# Altium schematic sheet 02_Connectors.SchDoc: Off Board Connectors
size A; Revision: A; SheetNumber: 2; SheetTotal: 4; ECE315_Project_Name: ECE453 F23 Base Project
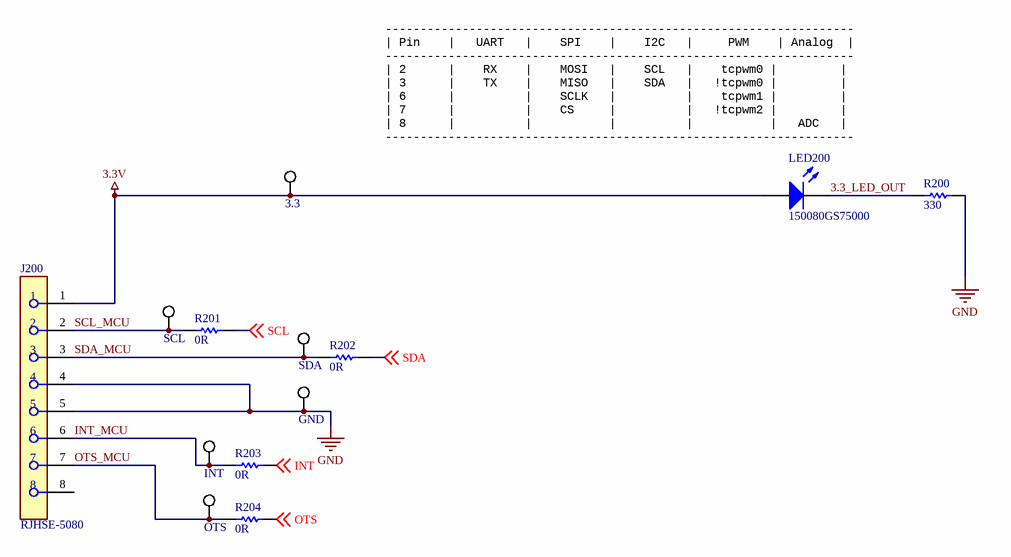
[diagram p0: 02_Connectors.SchDoc]

## Parts
3.3  5019  [KSTN-5019_V]  (value not drawn)
GND  5019  [KSTN-5019_V]  (value not drawn)
INT  5019  [KSTN-5019_V]  (value not drawn)
J200  RJHSE-5080  [FP-RJHSE-5080-MFG]
LED200  150080GS75000  [0805_A]
OTS  5019  [KSTN-5019_V]  (value not drawn)
R200  Resistance: 330  [RESC2013X60X35LL10T20]  (hidden comment: RC0805FR-07330RL)
R201  value 0R  [RES_0805]  (hidden comment: ERJ-6GEY0R00V)
R202  value 0R  [RESC2013X70X40NL20T20]  (hidden comment: ERJ-6GEY0R00V)
R203  value 0R  [RESC2013X70X40NL20T20]  (hidden comment: ERJ-6GEY0R00V)
R204  value 0R  [RESC2013X70X40NL20T20]  (hidden comment: ERJ-6GEY0R00V)
SCL  5019  [KSTN-5019_V]  (value not drawn)
SDA  5019  [KSTN-5019_V]  (value not drawn)

## Nets
3.3V: 3.3.1 J200.1 LED200.2(A)
GND: GND.1 J200.4 J200.5 R200.2
3.3_LED_OUT: LED200.1(K) R200.1
INT: R203.2 ; off-sheet INT
INT_MCU: INT.1 J200.6 R203.1
OTS: R204.2 ; off-sheet OTS
OTS_MCU: J200.7 OTS.1 R204.1
SCL: R201.2 ; off-sheet SCL
SCL_MCU: J200.2 R201.1 SCL.1
SDA: R202.2 ; off-sheet SDA
SDA_MCU: J200.3 R202.1 SDA.1

Not connected (* = marked no-connect by the designer): J200 8

## Notes on the sheet
- -------------------------------------------------------------------
  | Pin    |   UART   |    SPI    |    I2C   |     PWM    | Analog  |
  -------------------------------------------------------------------
  | 2      |    RX    |    MOSI   |    SCL   |    tcpwm0 |         |
  | 3      |    TX    |    MISO   |    SDA   |   !tcpwm0 |         |
  | 6      |          |    SCLK   |          |    tcpwm1 |         |
  | 7      |          |    CS     |          |   !tcpwm2 |         |
  | 8      |          |           |          |           |   ADC   |
  -------------------------------------------------------------------
- Title:
- Size:
- A
- Project
- Rev:
- Sheet:
- of
- College of Engineering
- 1415 Engineering Drive
- Madison, WI 53706

## Library data of the parts
3.3 GND INT OTS SCL SDA = CMP-1672-00008-1: Test Point, 1 Position SMD, RoHS, Tape and Reel; Manufacturer: Keystone Electronics; Plating: Silver; Body Material: Bronze; Supplier: Newark; Supplier Part Number: 59Y8500; Manufacturer Part Number: 5019; RoHS: Yes; Category: Connectors; Stock: 11269; Pricing: 1=0.411, 10=0.389, 25=0.285, 50=0.279, 100=0.273, 250=0.246 (USD); Mounting Technology: Surface Mount,PCB; Pins: 1; Contact Plating: Silver; Contact Material: Bronze; Material: Bronze; Packaging: Tape and Reel; Package Quantity: 1; Termination: SMD/SMT; Series: 5019; Height: 0.09inch; Reach SVHC Compliant: No; RoHS Compliant: Yes; Lead Free: Lead Free; ComponentLink1URL: https://datasheet.ciiva.com/14848/m60-2p61-14848437.pdf?src-supplier=Digi-Key; ComponentLink1Description: https://datasheet.ciiva.com/14848/m60-2p61-14848437.pdf?src-supplier=Digi-Key; ComponentLink2URL: https://datasheet.ciiva.com/14848/m60-2p61-14848438.pdf?src-supplier=Digi-Key; ComponentLink2Description: https://datasheet.ciiva.com/14848/m60-2p61-14848438.pdf?src-supplier=Digi-Key; ComponentLink3URL: https://datasheet.ciiva.com/14848/m60-2p61-14848439.pdf?src-supplier=Digi-Key; ComponentLink3Description: https://datasheet.ciiva.com/14848/m60-2p61-14848439.pdf?src-supplier=Digi-Key; ComponentLink4URL: https://datasheet.ciiva.com/16318/m60-2p61-16318395.pdf?src-supplier=Future+Electronics; ComponentLink4Description: https://datasheet.ciiva.com/16318/m60-2p61-16318395.pdf?src-supplier=Future+Electronics; ComponentLink5URL: https://datasheet.ciiva.com/16885/70182998-16885945.pdf?src-supplier=Allied+Electronics; ComponentLink5Description: https://datasheet.ciiva.com/16885/70182998-16885945.pdf?src-supplier=Allied+Electronics
J200 = CMP-02366-000003-1: CONN MOD JACK 8P8C R/A UNSHLD; Manufacturer: Amphenol; Current Rating: 1.5A; Voltage Rating: 125V; Pitch: 1.02mm; Conn Orientation: Right Angle; Number Of Contacts: 8; Is Female: yes; Conn Gender: Female; Contact Resistance: 20mR; Number of Ports: 1; Connector Type: RJ45; Lead Free: Yes; Device Class L3: unset; Footprint Url: https://cdn.amphenol-icc.com/media/wysiwyg/files/drawing/rjhse5080.pdf?__cf_chl_jschl_tk__=e349db0bbbb6188a39347cd5e541b92fa02c9719-1587748343-0-AW7tChdeHzRPLX9gSWj7WrKaXQoY9BsmT9Ek0h-T62M9y3Rs9iypFcOtkzb-6sGYQEjFE-jcoNciDETCOZrh1rYyOesac5SvYLoLwHIsHvF4AKBlx-MXmfZUVk9OTTJLqyQq2qMm0PFRLJpNcK0nrKResqOniRSYixG2sPTmOPraH-ULJFBDL602CHqcI9KKBgTq90Jh1OL2Td4moJ99rFsJRJ1Tk_uoxGe8ublcP_ARu-uLpWcQrBcwOcHDTAwL29DAwVaqcH7ta8Ks7WMlHmVl_pILeEDwT0bE9vu5Pa5S3PtNRF1leuFkgi_FMbUxTDulc5xzbXSfng8srUIV1lWXny5nx1fZJEUa_w97yKjffzBMxiWLWVN-V7-uqAaPbyv_m-wRyw5O25OZNyJOeGU; ComponentLink2URL: https://cdn.amphenol-icc.com/media/wysiwyg/files/documentation/datasheet/inputoutput/io-modjack-rjhse.pdf; Device Class L1: Connectors; Package: CONN_MOD_JACK; Mouser Description: Modular Connectors / Ethernet Connectors R/A RJ45 NONSHIELDED 8 CONT NO LEDS; Manufacturer Part Number: RJHSE-5080; Octopart: https://octopart.com/rjhse-5080-amphenol-45060; Category: Conn; Height: 0.535inch; Temperature: -55°C to +85°C; Digikey Description: CONN MOD JACK 8P8C R/A UNSHLD; Device Class L2: Modular / Ethernet Connectors; Contact Material: Gold,Nickel; ComponentLink2Description: Datasheet; Temperature Range Low: -55°C; RoHS: TRUE; Automotive: No; Temperature Range High: +85°C; Supplier: Newark; Supplier Part Number: 28T0105; Stock: 8640; Pricing: 1=0.966, 10=0.854, 25=0.808, 50=0.777, 100=0.748, 250=0.688, 500=0.627, 1000=0.568 (USD); Mounting Technology: Through Hole,Panel; Contact Plating: Gold; Max Current Rating: 1.5A; Number of Positions Loaded: 8; Max Voltage Rating (AC): 125V; Orientation: Right Angle; Packaging: Rail/Tube; Gender: Female; Termination: Solder; Number of Positions: 8; Voltage Rating (DC): 125V; Length: 15.75mm; Depth: 14.99mm; Radiation Hardening: No; RoHS Compliant: Yes; Reach SVHC Compliant: Unknown; ComponentLink1URL: https://datasheet.ciiva.com/7629/1682821-7629402.pdf?src-supplier=Element14; ComponentLink1Description: https://datasheet.ciiva.com/7629/1682821-7629402.pdf?src-supplier=Element14; ComponentLink3URL: https://datasheet.ciiva.com/685/rjhse5080-685586.pdf?src-supplier=Digi-Key; ComponentLink3Description: https://datasheet.ciiva.com/685/rjhse5080-685586.pdf?src-supplier=Digi-Key; ComponentLink4URL: https://datasheet.ciiva.com/1432/1693748-1432448.pdf?src-supplier=Element14; ComponentLink4Description: https://datasheet.ciiva.com/1432/1693748-1432448.pdf?src-supplier=Element14; ComponentLink5URL: https://datasheet.ciiva.com/15171/getdatasheetpartid-643190-15171163.pdf?src-supplier=Verical; ComponentLink5Description: https://datasheet.ciiva.com/15171/getdatasheetpartid-643190-15171163.pdf?src-supplier=Verical
LED200 = CMP-1426-00007-1: SMD mono-color Chip LED, WL-SMCW, Green; Manufacturer: Wuerth Elektronik; Manufacturer 1: Wurth Electronics; Viewing Angle: 140°; Lens Style: Clear,Rectangular; Luminous Intensity: 450mcd; Forward Voltage: 3.2V; Wavelength: 520nm; Forward Current: 30mA; Test Current: 20mA; Lens Color: Colorless; Lens Transparency: Clear; Lens Size: 1.25mm; PackageReference: 0805_A; Color: Green; PartNumber: 150080GS75000; ComponentLink2URL: http://katalog.we-online.com/led/datasheet/150080GS75000.pdf; ComponentLink1URL: http://www.we-online.com; ComponentLink1Description: Manufacturer URL; ComponentLink2Description: Datasheet; Supplier 1: Digi-Key; Supplier Part Number 1: 732-4983-1-ND; Manufacturer Part Number 1: 150080GS75000; RoHS: Yes; Category: LEDs; Stock 1: 95801; Pricing 1: 1=0.19000, 50=0.17600, 100=0.15100, 500=0.13100 (USD); Mount: Surface Mount; Case/Package: 0805; Case Code (Metric): 2012; Case Code (Imperial): 0805; Min Operating Temperature: -40°C; Max Operating Temperature: 85°C; Package Quantity: 4000; Packaging: Cut Tape; Dominant Wavelength: 520nm; Length: 2mm; Width: 1.25mm; Height: 0.7mm; REACH SVHC: Unknown; RoHS Compliant: Yes; ComponentLink3URL: https://datasheet.ciiva.com/29563/150080gs75000-29563008.pdf?src-supplier=Digi-Key; ComponentLink3Description: https://datasheet.ciiva.com/29563/150080gs75000-29563008.pdf?src-supplier=Digi-Key; ComponentLink4URL: https://datasheet.ciiva.com/29279/759434-da-01-en-chipled-0805-w-kl-gruen-150080gs75000-29279039.pdf?src-supplier=Conrad; ComponentLink4Description: https://datasheet.ciiva.com/29279/759434-da-01-en-chipled-0805-w-kl-gruen-150080gs75000-29279039.pdf?src-supplier=Conrad; Supplier: Newark; Supplier Part Number: 95W3800; Manufacturer Part Number: 150080GS75000; Stock: 59977; Pricing: 1=0.194, 5=0.194, 10=0.191, 25=0.186, 50=0.18, 100=0.154, 500=0.141 (USD); Mounting Technology: Surface Mount; Series: WL-SMCW; Reach SVHC Compliant: Unknown
R200 = CMP-2000-06960-1: Chip Resistor, 330 Ohm, +/- 1%, 125 mW, -55 to 155 degC, 0805 (2012 Metric), RoHS, Tape and Reel; Manufacturer: Yageo; Manufacturer Part Number: CRCW0805330RFKEA; Voltage Rating: 150V; Temperature Coefficient: 100PPM/C; Power Rating: 125mW(1/8W); Max Power Dissipation: 125mW; Value: 330R; Datasheet Version: Rev. 7, 05/2017; Termination Style: SMD/SMT; Case Code - mm: 2012; Package Description: 2-Pin Surface Mounted Device, Body 2 x 1.25 mm; Operating Temperature Range: -55Cto+155C; Case Code - in: 0805; Packaging: Reel; Tolerance: 1%; Package Reference: 0805; Mounting Technology: SurfaceMount; Product: ThickFilmResistorsGeneralPurpose; Series: RC; Manufacturer URL: http://www.yageo.com/; Datasheet URL: http://www.yageo.com/documents/recent/PYu-RC_Group_51_RoHS_L_7.pdf; Supplier 1: Digi-Key; Supplier Part Number 1: 311-330CRCT-ND; Manufacturer 1: Yageo; Manufacturer Part Number 1: RC0805FR-07330RL; RoHS: Yes; Category: Chip SMD Resistors; Stock 1: 1297787; Pricing 1: 1=0.10000, 10=0.03700, 100=0.01510, 1000=0.00680, 2500=0.00590 (USD); Case/Package: 0805; Case Code (Imperial): 0805; Case Code (Metric): 2012; Size Code: 0805; Min Operating Temperature: -55°C; Max Operating Temperature: 155°C; Package Quantity: 5000; Termination: SMD/SMT; Construction: Rectangular; Resistor Type: Thick Film; Number of Terminations: 2; Features: Moisture Resistant; Resistance Tolerance: 1%; Length: 0.079inch; Width: 0.049inch; Height: 0.024inch; Depth: 1.25mm; RoHS Compliant: Yes; Military Standard: Not; Lead Free: Lead Free; ComponentLink1URL: https://datasheet.ciiva.com/2457/pyu-r-int-thick-7-2457015.pdf?src-supplier=Digi-Key; ComponentLink1Description: https://datasheet.ciiva.com/2457/pyu-r-int-thick-7-2457015.pdf?src-supplier=Digi-Key; ComponentLink2URL: https://datasheet.ciiva.com/2457/pyu-r-int-thick-7-2457016.pdf?src-supplier=Digi-Key; ComponentLink2Description: https://datasheet.ciiva.com/2457/pyu-r-int-thick-7-2457016.pdf?src-supplier=Digi-Key; ComponentLink3URL: https://datasheet.ciiva.com/2457/pyu-r-int-thick-7-2457014.pdf?src-supplier=Digi-Key; ComponentLink3Description: https://datasheet.ciiva.com/2457/pyu-r-int-thick-7-2457014.pdf?src-supplier=Digi-Key; ComponentLink4URL: https://datasheet.ciiva.com/12667/rc0805-12667925.pdf?src-supplier=Mouser; ComponentLink4Description: https://datasheet.ciiva.com/12667/rc0805-12667925.pdf?src-supplier=Mouser; ComponentLink5URL: https://datasheet.ciiva.com/7941/444164-7941768.pdf?src-supplier=Element14; ComponentLink5Description: https://datasheet.ciiva.com/7941/444164-7941768.pdf?src-supplier=Element14; ComponentLink6URL: https://datasheet.ciiva.com/7941/444164-7941769.pdf?src-supplier=Element14; ComponentLink6Description: https://datasheet.ciiva.com/7941/444164-7941769.pdf?src-supplier=Element14; ComponentLink7URL: https://datasheet.ciiva.com/16740/rc0805-16740975.pdf?src-supplier=Future+Electronics; ComponentLink7Description: https://datasheet.ciiva.com/16740/rc0805-16740975.pdf?src-supplier=Future+Electronics; Supplier: Newark; Supplier Part Number: 53K0164; Stock: 218356; Pricing: 1=0.02, 25=0.02, 50=0.02, 100=0.02 (USD); Contact Plating: Tin; Weight: 0.000194oz; Voltage Rating (DC): 150V; Ratings: AEC-Q200; Reach SVHC Compliant: Unknown; ComponentLink8URL: https://datasheet.ciiva.com/8944/dcrcwe3-8944773.pdf?src-supplier=Avnet; ComponentLink8Description: https://datasheet.ciiva.com/8944/dcrcwe3-8944773.pdf?src-supplier=Avnet; ComponentLink9URL: https://datasheet.ciiva.com/8944/dcrcwe3-8944776.pdf?src-supplier=Avnet; ComponentLink9Description: https://datasheet.ciiva.com/8944/dcrcwe3-8944776.pdf?src-supplier=Avnet; ComponentLink10URL: https://datasheet.ciiva.com/7777/1697337-7777390.pdf?src-supplier=Element14; ComponentLink10Description: https://datasheet.ciiva.com/7777/1697337-7777390.pdf?src-supplier=Element14; ComponentLink11URL: https://datasheet.ciiva.com/16769/70201119-16769852.pdf?src-supplier=Allied+Electronics; ComponentLink11Description: https://datasheet.ciiva.com/16769/70201119-16769852.pdf?src-supplier=Allied+Electronics
R201-R204 = CMP-1665-00002-5: Chip Resistor, 0 Ohm, +/- 1%, 0.125 W, -55 to 155 degC, 0805 (2012 Metric), RoHS, Tape and Reel; Manufacturer: Panasonic; Tolerance: 5%; Resistance: 0 Ohm; Power Rating: 125mW; Temperature Coefficient: 600ppm/°C; Voltage Rating: 150V; Current Rating: 2A; REACH SVHC: No SVHC; Min Operating Temperature: -55 degC; Case/Package: 0805; Packaging: Tape and Reel; Package Quantity: 5000; ComponentLink1Description: Manufacturer URL; PackageDescription: 2-Pin Surface Mount Device, Body 2 x 1.25 mm; Mounting Technology: Surface Mount; Max Operating Temperature: 155 degC; PartNumber: ERJ-6GEY0R00V; Width: 1.25 mm; RoHSCompliant: True; Height: 0.6 mm; ComponentLink1URL: http://www.panasonic.com/; ComponentLink2URL: http://industrial.panasonic.com/cdbs/www-data/pdf/RDA0000/AOA0000C84.pdf; Case Code (Imperial): 0805; DatasheetVersion: 03/2015; Length: 2 mm; Case Code (Metric): 2012; ComponentLink2Description: Datasheet; Radiation Hardening: No; Supplier: Newark; Supplier Part Number: 65T8846; Manufacturer Part Number: ERJ-6GEY0R00V; RoHS: Yes; Category: Chip SMD Resistors; Stock: 200593; Pricing: 1=0.008, 25=0.008, 50=0.008, 100=0.008, 250=0.008, 500=0.008, 1000=0.008 (USD); Contact Plating: Tin; Series: ERJ; Termination: SMD/SMT; Resistor Type: Thick Film; Number of Terminations: 2; Technology: THICK FILM; Construction: Rectangular; Max Power Dissipation: 125mW; Voltage Rating (DC): 150V; Features: Automotive AEC-Q200; Depth: 1.25mm; Ratings: AEC-Q200; RoHS Compliant: Yes; Reach SVHC Compliant: No; Military Standard: Not; Lead Free: Lead Free